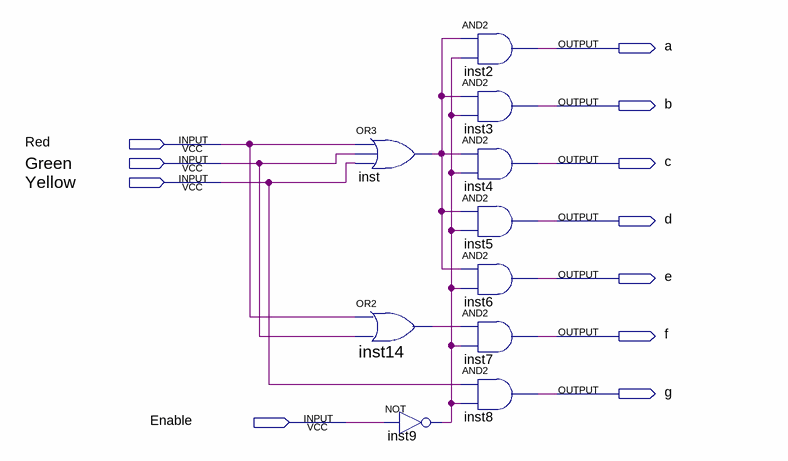
[diagram p0: schematic sheet]
// Quartus schematic FNDarray1.bdf as structural Verilog: 10 symbols, 11 pins
module FNDarray1 (
  input  Red,
  input  Green,
  input  Yellow,
  input  Enable,
  output a,
  output b,
  output c,
  output d,
  output e,
  output f,
  output g
);

  wire inst9_out, inst14_out, inst_out;

  or inst (inst_out, Red, Green, Yellow);
  or inst14 (inst14_out, Red, Green);
  not inst9 (inst9_out, Enable);
  and inst2 (a, inst_out, inst9_out);
  and inst3 (b, inst_out, inst9_out);
  and inst4 (c, inst_out, inst9_out);
  and inst5 (d, inst_out, inst9_out);
  and inst6 (e, inst_out, inst9_out);
  and inst7 (f, inst14_out, inst9_out);
  and inst8 (g, Yellow, inst9_out);
endmodule
